# EAGLE design Main-avionics-3.5 (EAGLE 9.6.2)
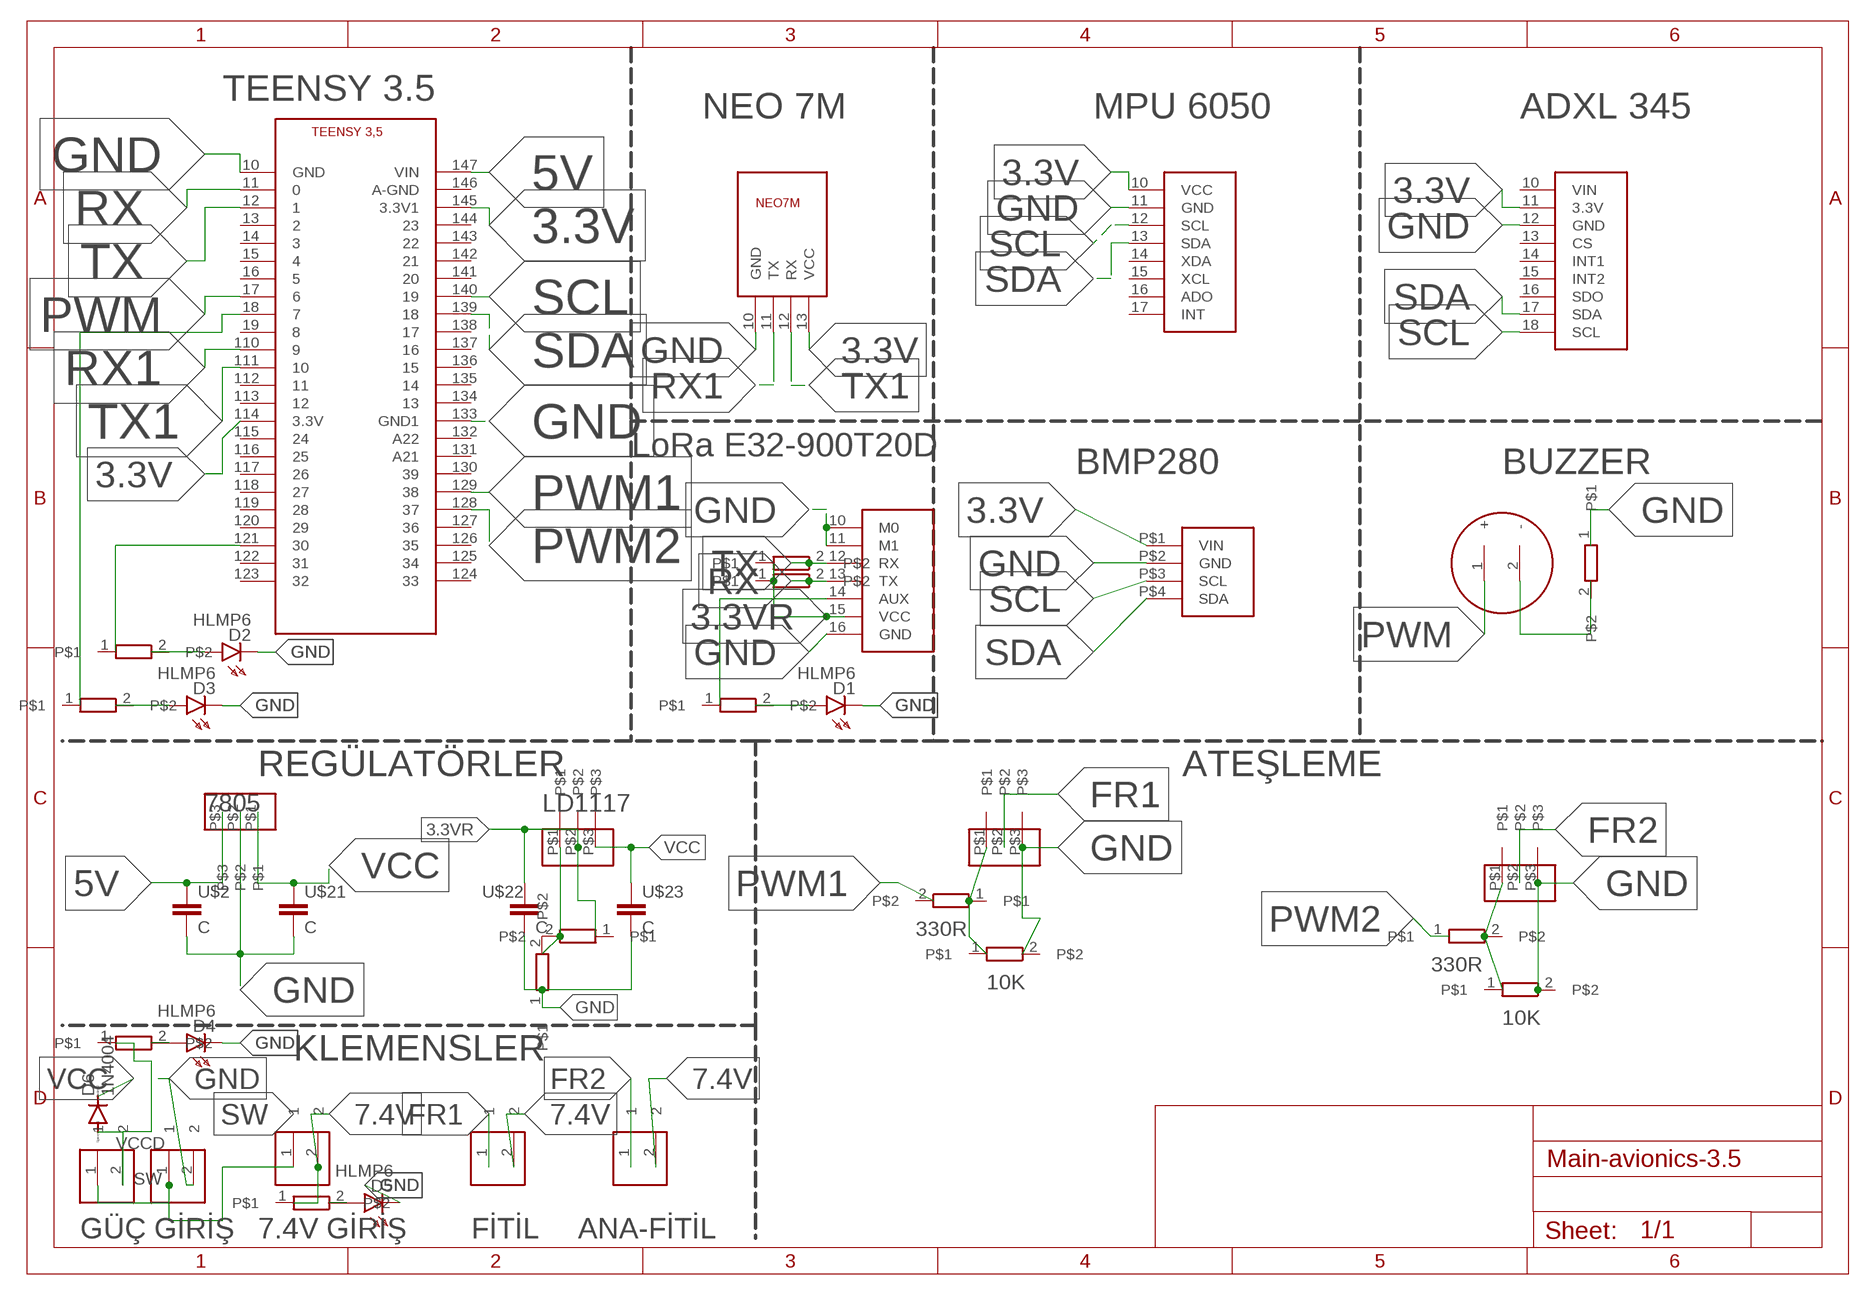
[diagram p0: schematic, sheet 1]

## Parts
1K  R  [0204/7]
10R  R  [0204/7]
10R1  R  [0204/7]
10R2  R  [0204/7]
10R3  R  [0204/7]
10R4  R  [0204/7]
10R5  R  [0204/7]
10R6  R  [0204/7]
10R7  R  [0204/7]
10R8  R  [0204/7]
10R9  R  [0204/7]
D1  HLMP6  [HLMP6]
D2  HLMP6  [HLMP6]
D3  HLMP6  [HLMP6]
D4  HLMP6  [HLMP6]
D5  HLMP6  [HLMP6]
D6  1N4004  [DO41-10]
U$1  ADXL345  [ADXL345]
U$2  C  [C075-032X103]
U$3  BUZZEER  [BUZZER]
U$4  KLEMENS  [KLEMENS]
U$5  KLEMENS  [KLEMENS]
U$6  LORA  [LORA]
U$7  KLEMENS  [KLEMENS]
U$8  NEO7M  [NEO7M]
U$9  REGULATOR  [REGULATOR]
U$11  TEENSY  [TEENSY]
U$13  MPU6050  [MPU6050]
U$14  KLEMENS  [KLEMENS]
U$15  R  [0204/7]
U$16  KLEMENS  [KLEMENS]
U$17  R  [0204/7]
U$18  R  [0204/7]
U$19  REGULATOR  [REGULATOR]
U$20  BMP280  [BMP280]
U$21  C  [C075-032X103]
U$22  C  [C075-032X103]
U$23  C  [C075-032X103]
U$24  REGULATOR  [REGULATOR]
U$25  REGULATOR  [REGULATOR]

## Nets
3.3V: U$1.11(3.3V) U$8.13(VCC) U$11.114(3.3V) U$11.145(3.3V1) U$13.10(VCC) U$20.P$1(VIN)
3.3VR: 10R1.1 10R2.1 10R4.1 U$6.15(VCC) U$22.1 U$24.P$2
5V: U$2.1 U$11.147(VIN) U$19.P$3
7.4V: 10R9.1 U$4.2 U$7.2 U$14.2
FR1: U$4.1 U$25.P$2
FR2: U$7.1 U$9.P$2
GND: 10R5.1 10R.2 D1.K D2.K D3.K D4.K D5.K U$1.12(GND) U$2.2 U$6.10(M0) U$6.11(M1) U$6.16(GND) U$8.10(GND) U$9.P$3 U$11.10(GND) U$11.133(GND1) U$13.11(GND) U$15.1 U$16.2 U$18.2 U$19.P$2 U$20.P$2(GND) U$21.2 U$22.2 U$23.2 U$25.P$3
N$1: U$3.2(-) U$15.2
N$2: U$9.P$1 U$17.2 U$18.1
N$3: 10R3.2 D1.A
N$4: 10R3.1 U$6.14(AUX)
N$6: 1K.1 10R.1 U$25.P$1
N$10: 10R6.2 D2.A
N$11: 10R6.1 U$11.121
N$12: 10R7.2 D3.A
N$13: 10R7.1 U$11.18
N$14: 10R8.2 D4.A
N$15: 10R9.2 D5.A
PWM: U$3.1(+) U$11.17
PWM1: 1K.2 U$11.129
PWM2: U$11.128 U$17.1
RX: 10R2.2 U$6.13(TX) U$11.11
RX1: U$8.11(TX) U$11.110
SCL: U$1.18(SCL) U$11.140 U$13.12(SCL) U$20.P$3(SCL)
SDA: U$1.17(SDA) U$11.139 U$13.13(SDA) U$20.P$4(SDA)
SW: U$5.1 U$14.1 U$16.1
T: 10R4.2 10R5.2 U$24.P$1
TX: 10R1.2 U$6.12(RX) U$11.12
TX1: U$8.12(RX) U$11.111
VCC: D6.C U$19.P$1 U$21.1 U$23.1 U$24.P$3
VCCD: 10R8.1 D6.A U$5.2
Unconnected: U$1.10(VIN) U$1.13(CS) U$1.14(INT1) U$1.15(INT2) U$1.16(SDO) U$11.13 U$11.14 U$11.15 U$11.16 U$11.19 U$11.112 U$11.113 U$11.115 U$11.116 U$11.117 U$11.118 U$11.119 U$11.120 U$11.122 U$11.123 U$11.124 U$11.125 U$11.126 U$11.127 U$11.130 U$11.131(A21) U$11.132(A22) U$11.134 U$11.135 U$11.136 U$11.137 U$11.138 U$11.141 U$11.142 U$11.143 U$11.144 U$11.146(A-GND) U$13.14(XDA) U$13.15(XCL) U$13.16(ADO) U$13.17(INT)

## Notes on the sheet
- TEENSY 3.5
- NEO 7M | MPU 6050 | ADXL 345
- LoRa E32-900T20D
- BMP280 | BUZZER
- REGÜLATÖRLER | ATEŞLEME
- 7805 | LD1117
- 330R
- 330R
- 10K
- 10K
- KLEMENSLER
- GÜÇ GİRİŞ | 7.4V GİRİŞ | FİTİL | ANA-FİTİL

## Library data of the parts
1K 10R 10R1-10R9 U$15 U$17 U$18 = KARTSON:R
D1-D5 = display-hp:HLMP6: LED 2mm horizontal; MF: AGILENT TECHNOLOGIES; MPN: HLMP-6500; OC_FARNELL: 1652490; OC_NEWARK: 40K0088
D6 = diode:1N4004: DIODE general purpose rectifier, 1 A
U$1 = KARTSON:ADXL345
U$2 U$21-U$23 = KARTSON-RE:C
U$3 = KARTSON:BUZZEER
U$4 U$7 U$14 = KARTSON:KLEMENS
U$5 U$16 = KARTYENİ:KLEMENS
U$6 = KARTYENİ:LORA
U$8 = KARTYENİ:NEO7M
U$9 U$19 U$24 U$25 = KARTSON-RE:REGULATOR
U$11 = KARTSON:TEENSY
U$13 = KARTSON:MPU6050
U$20 = KARTSON:BMP280

## Board
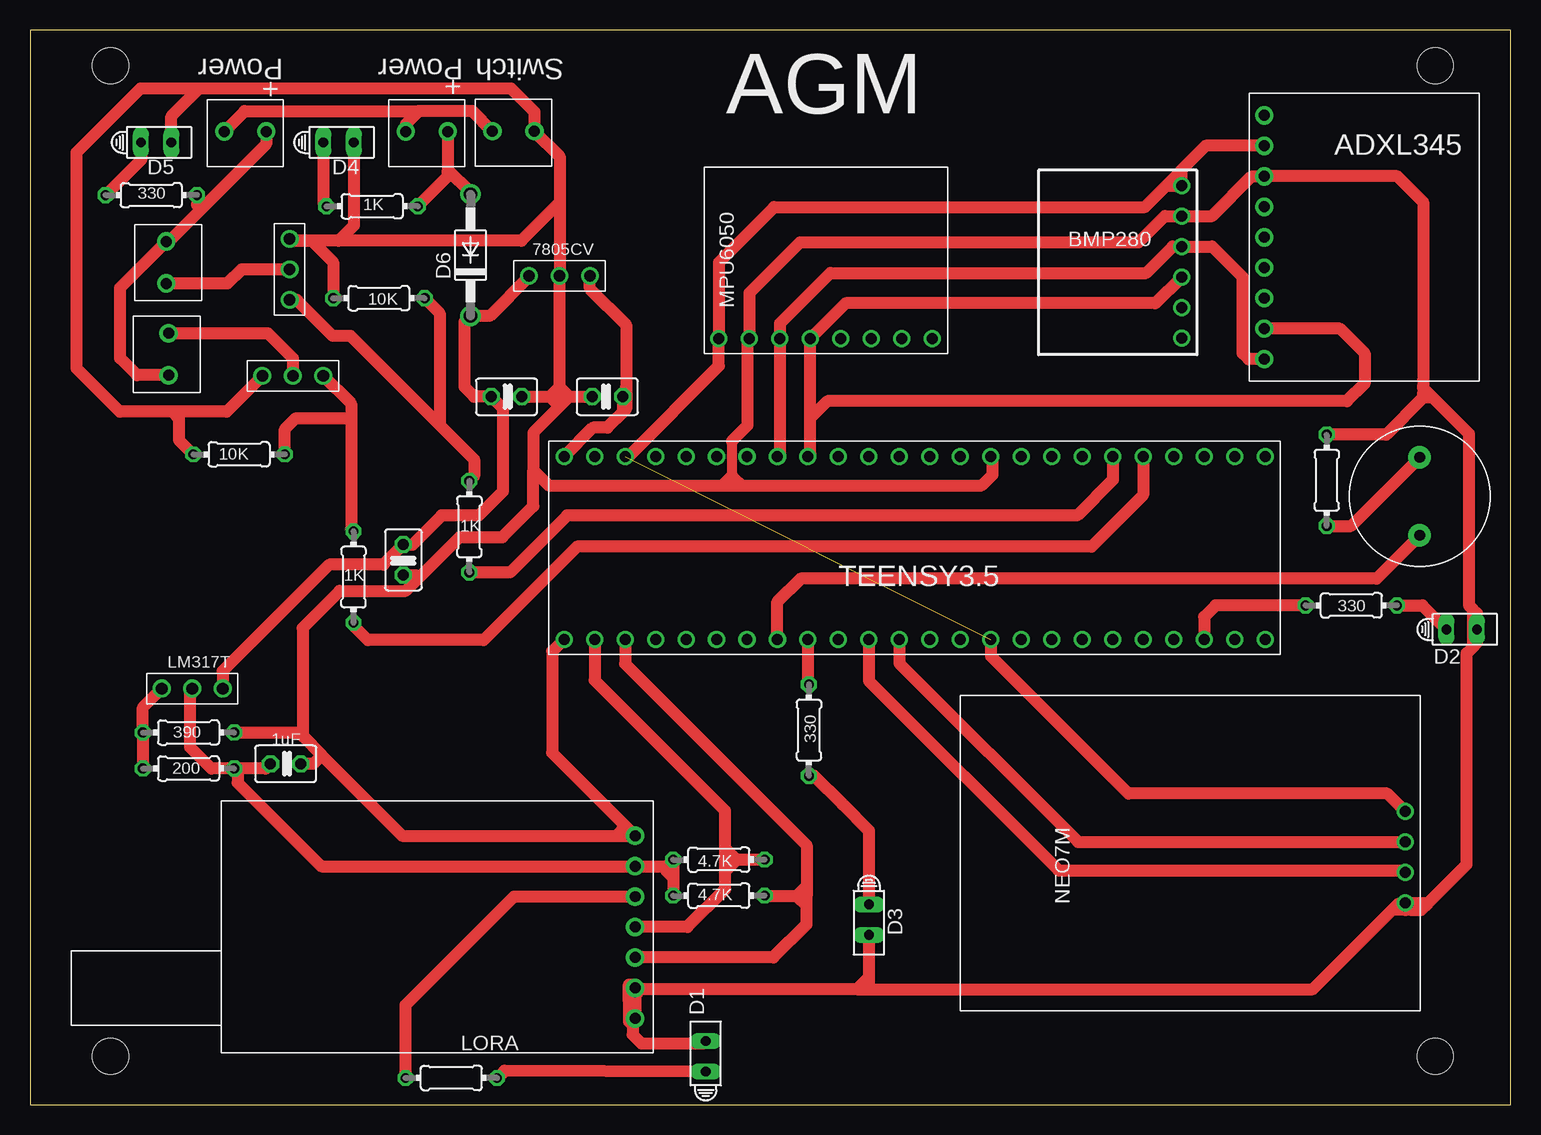
[diagram p1: board, top side]

Size 123.38 x 89.61 mm. Coordinates in mm from the lower left corner, seen from the top.
Outline: 0,0 123.38,0 123.38,89.61 0,89.61 0,0
Copper layers (1*16): Top 0.035mm / dielectric 1.5mm / Bottom 0.035mm
Design rules "default": minimum track width 6mil, minimum drill 0.35mm, track to track 6mil, track to pad 6mil, pad to pad 6mil, via to via 6mil, smd to smd 6mil, copper to edge 40mil, drill to drill 6mil, minimum pad ring 10mil, minimum via ring 8mil, stop-mask expansion 4mil, vias tented up to drill 0mil, thermal gap 10mil
Holes 3 mm at 117.11,86.64 117.11,4.04 6.71,86.64 6.71,4.04

### Footprints (pad centres in the part's own frame; a part is rotated, then mirrored left to right if it is on the bottom)
0204/7 = drill 0.813 octagon: 1 -3.81,0; 2 3.81,0
HLMP6 = drill 0.813 long: A -1.27,0; K 1.27,0
DO41-10 = drill 1.118: A 5.08,0; C -5.08,0
ADXL345 = drill 0.914 pad 1.524: 10 1.27,22.16; 11 1.27,19.62; 12 1.27,17.08; 13 1.27,14.54; 14 1.27,12; 15 1.27,9.46; 16 1.27,6.92; 17 1.27,4.38; 18 1.27,1.84
C075-032X103 = drill 0.914 octagon: 1 -1.27,0; 2 1.27,0
BUZZER = drill 0.889 pad 1.88: 1 -3.251,0; 2 3.251,0
KLEMENS = drill 0.914 pad 1.524: 1 1.425,2.94; 2 4.925,2.94
LORA = drill 0.914 pad 1.524: 10 1.5,18.12; 11 1.5,15.58; 12 1.5,13.04; 13 1.5,10.5; 14 1.5,7.96; 15 1.5,5.42; 16 1.5,2.88
NEO7M = drill 0.914: 10 9,1.27; 11 11.54,1.27; 12 14.08,1.27; 13 16.62,1.27
REGULATOR = drill 0.965: P$1 1.27,1.27; P$2 3.81,1.27; P$3 6.35,1.27
TEENSY = drill 0.914: 10 1.27,59.69; 11 1.27,57.15; 12 1.27,54.61; 13 1.27,52.07; 14 1.27,49.53; 15 1.27,46.99; 16 1.27,44.45; 17 1.27,41.91; 18 1.27,39.37; 19 1.27,36.83; 110 1.27,34.29; 111 1.27,31.75; 112 1.27,29.21; 113 1.27,26.67; 114 1.27,24.13; 115 1.27,21.59; 116 1.27,19.05; 117 1.27,16.51; 118 1.27,13.97; 119 1.27,11.43; 120 1.27,8.89; 121 1.27,6.35; 122 1.27,3.81; 123 1.27,1.27; 124 16.51,1.27; 125 16.51,3.81; 126 16.51,6.35; 127 16.51,8.89; 128 16.51,11.43; 129 16.51,13.97; 130 16.51,16.51; 131 16.51,19.05; 132 16.51,21.59; 133 16.51,24.13; 134 16.51,26.67; 135 16.51,29.21; 136 16.51,31.75; 137 16.51,34.29; 138 16.51,36.83; 139 16.51,39.37; 140 16.51,41.91; 141 16.51,44.45; 142 16.51,46.99; 143 16.51,49.53; 144 16.51,52.07; 145 16.51,54.61; 146 16.51,57.15; 147 16.51,59.69
MPU6050 = drill 0.914: 10 1.27,19.05; 11 1.27,16.51; 12 1.27,13.97; 13 1.27,11.43; 14 1.27,8.89; 15 1.27,6.35; 16 1.27,3.81; 17 1.27,1.27
BMP280 = drill 0.914: P$1 1.27,1.27; P$2 1.27,3.81; P$3 1.27,6.35; P$4 1.27,8.89; P$5 1.27,11.43; P$6 1.27,13.97

### Placement (x,y rotation side)
1K  36.61,48.2 270 top
10R  29.08,67.25 180 top
10R1  57.41,17.44 0 top
10R2  57.41,20.44 0 top
10R3  35.11,2.24 0 top
10R4  13.21,28.04 180 top
10R5  13.21,31.04 180 top
10R6  110.11,41.64 0 top
10R7  64.91,31.24 270 top
10R8  28.51,74.91 180 top
10R9  10.11,75.84 180 top
D1  56.31,4.04 90 top
D2  119.31,39.64 0 top
D3  69.91,15.44 270 top
D4  25.71,80.24 0 top
D5  10.51,80.24 0 top
D6  36.71,70.84 90 top
U$1  101.59,60.33 0 top
U$2  48.11,59.04 180 top
U$3  115.81,50.73 90 top
U$4  14.3,67.05 90 top
U$5  29.89,78.2 0 top
U$6  51.92,25.32 180 top
U$7  8.61,65.75 270 top
U$8  115.86,7.83 90 top
U$9  25.71,62.04 180 top
U$11  104.2,37.54 90 top
U$13  76.46,62.61 90 top
U$14  14.76,78.21 0 top
U$15  108.06,52.07 270 top
U$16  37.11,78.24 0 top
U$17  26.96,44 90 top
U$18  17.42,54.23 180 top
U$19  40.31,67.84 0 top
U$20  97.24,77.91 180 top
U$21  31.11,45.44 270 top
U$22  21.31,28.44 0 top
U$23  39.71,59.04 0 top
U$24  9.71,33.44 0 top
U$25  22.91,65.84 90 top

### Tracks (layer width: path | path; a pad name or v marks a point on that pad's centre or on a via)
3.3V  (1 unrouted)
  Top 1.016: U$11.145 49.85,54.05 57.41,61.61 U$13.10 57.41,70.23 62.02,74.84 92.9,74.84 94.7,76.64 | 94.7,76.64 U$20.P$1 95.97,77.91 | 95.97,77.91 95.97,77.95 97.97,79.95 U$1.11 | 94.7,76.64 95.97,77.91 | U$11.114 80.07,37.41 91.53,25.95 113.09,25.95 U$8.13
3.3VR
  Top 1.016: 53.06,19.9 U$6.15 24.25,19.9 17.31,26.84 17.31,27.75 10R4.1 | 53.06,19.9 10R2.1 53.6,18.94 | 53.6,18.94 10R1.1 | 53.6,18.94 53.06,19.48 53.06,19.9 | U$22.1 19.64,28.04 10R4.1 | 10R4.1 15.11,28.04 13.32,29.83 13.32,34.51 U$24.P$2
5V
  Top 1.016: U$11.147 46.91,56.45 48.11,56.45 49.38,57.72 | U$19.P$3 46.66,68.05 49.68,65.03 49.68,59.84 49.68,59.34 | 49.68,59.34 U$2.1 49.38,57.72 | 49.68,59.34 49.68,58.02 49.38,57.72
7.4V
  Top 1.016: U$7.2 8.93,60.82 7.51,62.24 7.51,68.12 U$4.2 11.56,71.98 14.64,75.05 | U$14.2 19.69,80.1 14.64,75.05 | 10R9.1 13.92,75.05 | 13.92,75.05 13.91,75.04 | 14.64,75.05 13.92,75.05
FR1
  Top 1.016: U$25.P$2 17.63,69.65 16.46,68.48 U$4.1
FR2
  Top 1.016: U$7.1 19.82,64.33 21.9,62.25 U$9.P$2
GND
  Top 0.813: 58.48,55.32 | 58.48,55.32 58.48,52.44
  Top 1.016: 116.08,59.95 116.07,58.95 | 116.08,59.95 116.09,60.44 116.09,75.26 113.94,77.41 U$1.12 101.82,77.41 98.51,74.1 U$20.P$2 94.57,74.1 92.37,71.9 64.16,71.9 59.95,67.69 U$13.11 59.79,63.72 59.79,56.63 58.48,55.32 | 44.14,59.84 44.14,59.04 | 44.14,58.24 44.14,59.04 | U$11.133 80.21,53.91 80.21,52.54 79.31,51.64 59.11,51.64 | 57.68,51.64 43.21,51.64 41.94,52.91 | 57.68,51.64 58.51,51.64 | 58.51,51.64 59.11,51.64 | 14.11,84.74 40.08,84.74 42.04,82.78 U$16.2 44.14,79.08 44.14,75.24 | 115.21,16.83 U$8.10 114.5,16.74 | 115.21,16.83 115.71,16.83 | 115.71,16.83 116.5,16.83 | 116.5,16.83 119.71,20.04 119.71,37.64 120.21,38.14 | 116.91,58.95 116.07,58.95 | U$11.10 43.51,37.81 43.51,29.35 49.66,23.2 | 49.66,23.2 U$6.16 48.91,22.44 | U$6.11 50.42,9.15 | 50.42,9.15 U$6.10 50.42,8.14 50.22,8.34 | D1.K 56.11,5.11 50.95,5.11 50.22,5.84 50.22,6.64 | 50.22,6.64 50.22,8.34 | 68.91,9.64 50.91,9.64 | 68.91,9.64 70.11,9.64 | 70.11,9.64 106.9,9.64 113.5,16.24 | 113.5,16.24 114,16.74 114.5,16.74 | 114.5,16.74 115.12,16.74 | 115.12,16.74 115.21,16.83 | 116.91,58.95 119.91,55.95 119.91,41.64 120.58,40.97 D2.K 120.58,38.51 120.21,38.14 | 116.91,58.95 116.08,59.77 116.08,59.95 | 32.41,43.94 35.8,47.33 39.36,47.33 41.94,49.91 41.94,52.91 | 32.41,43.94 31.31,42.84 25.81,42.84 22.71,39.74 22.71,30.74 | 24.31,29.14 31.01,22.44 48.91,22.44 | 48.91,22.44 49.66,23.2 | 115.12,16.74 114.62,16.24 | 114.62,16.24 113.5,16.24 | 50.22,8.34 49.91,8.65 | 49.91,8.65 49.91,10.04 50.51,10.04 50.91,9.64 | 49.91,8.65 49.91,6.95 50.22,6.64 | D3.K 69.91,10.64 | 69.91,10.64 68.91,9.64 | 69.91,10.64 69.91,9.84 70.11,9.64 | 22.71,30.74 22.41,31.04 10R5.1
  Top 1.016: 22.71,30.74 24.31,29.14 | U$23.2 43.31,59.04 | 44.14,59.04 43.31,59.04 | 44.14,59.04 44.94,59.04 | 44.94,59.04 U$2.2 | D5.K 11.78,82.41 14.11,84.74 | 115.71,16.83 115.12,16.24 | 115.12,16.24 114.62,16.24 | 115.12,16.24 115.91,16.24 116.5,16.83 | 43.31,59.04 44.11,59.84 44.14,59.84 | 44.14,59.84 44.94,59.04 | 44.94,59.04 44.14,58.24 | 44.14,58.24 41.94,56.04 41.94,52.91 | 43.31,59.04 44.11,58.24 44.14,58.24 | 50.91,9.64 50.42,9.15 | 11.84,57.79 7.48,57.79 3.88,61.39 3.88,79.41 9.21,84.74 14.11,84.74 | 58.51,51.64 58.48,51.67 58.48,52.44 | 58.48,52.44 57.68,51.64 | 58.48,52.44 59.11,51.81 59.11,51.64 | U$18.2 12.41,55.43 12.41,57.22 11.84,57.79 | 116.07,58.95 113,55.88 U$15.1 | 44.14,75.24 44.14,69.09 | 44.14,69.09 U$19.P$2 | 44.14,59.84 44.14,69.09 | 24.31,29.14 23.61,28.44 U$22.2 | U$21.2 32.18,44.17 32.41,43.94 | 119.98,41.57 120.21,41.34 120.21,38.14 | 10R.2 25.27,70.25 23.53,71.99 21.84,71.99 U$25.P$3 21.79,72.04 25.71,72.04 | U$9.P$3 16.38,57.79 11.84,57.79 | 44.14,75.24 40.94,72.04 25.71,72.04 | D4.K 26.98,73.31 25.71,72.04
N$1
  Top 1.016: U$15.2 110.09,48.26 U$3.2
N$2
  Top 1.016: 26.76,57.24 26.76,48.01 U$17.2 | 26.76,57.24 22.15,57.24 21.23,56.32 U$18.1 | 26.76,57.24 26.76,58.45 U$9.P$1
N$3
  Top 1.016: D1.A 39.55,2.86 10R3.2
N$4
  Top 1.016: U$6.14 40.33,17.36 31.3,8.33 10R3.1
N$6
  Top 1.016: 1K.1 37.01,52.41 37.01,53.81 34.15,56.67 | U$25.P$1 22.24,67.11 25.24,64.11 26.71,64.11 34.15,56.67 | 34.15,56.67 34.15,66 10R.1
N$10
  Top 1.016: D2.A 116.04,41.64 10R6.2
N$11
  Top 1.016: 10R6.1 98.8,41.64 97.85,40.69 U$11.121
N$12
  Top 1.016: 10R7.2 65.32,27.43 67.71,25.04 69.91,22.84 D3.A
N$13
  Top 1.016: U$11.18 64.83,35.13 10R7.1
N$14
  Top 1.016: D4.A 24.44,75.17 10R8.2
N$15
  Top 1.016: 10R9.2 9.31,78.84 9.31,80.17 D5.A
PWM
  Top 1.016: U$11.17 62.29,41.95 64.22,43.88 112.21,43.88 U$3.1
PWM1
  Top 1.016: U$11.129 90.23,52.11 87.26,49.14 44.76,49.14 40.01,44.39 1K.2
PWM2
  Top 1.016: U$11.128 92.77,50.84 88.46,46.53 45.6,46.53 37.81,38.74 28.16,38.74 26.84,40.06 U$17.1
RX
  Top 1.016: U$11.11 47.05,35.4 57.91,24.54 57.91,21.44 | U$6.13 54.79,14.82 57.91,17.94 57.91,19.44 | 10R2.2 58.91,20.44 | 57.91,20.44 58.91,20.44 | 57.91,21.44 57.91,20.44 | 57.91,20.44 57.91,19.44 | 57.91,21.44 58.91,20.44 | 58.91,20.44 57.91,19.44
RX1
  Top 1.016: U$11.110 69.91,35.34 85.71,19.54 114.42,19.54 U$8.11
SCL
  Top 1.016: U$11.140 62.49,54.25 U$13.12 62.49,65.15 66.7,69.36 93.01,69.36 95.21,71.56 U$20.P$3 98.51,71.56 101.05,69.02 101.05,62.67 101.55,62.17 U$1.18
SDA
  Top 1.016: U$11.139 65.03,54.25 65.03,57.24 | 65.03,57.24 U$13.13 67.97,66.82 93.77,66.82 U$20.P$4 | U$1.17 109.17,64.71 111.21,62.67 111.21,60.13 109.74,58.66 66.45,58.66 65.03,57.24
SW
  Top 1.016: U$14.1 17.88,82.84 32.38,82.84 | U$16.1 36.88,82.84 32.38,82.84 | 32.38,82.84 31.31,81.78 U$5.1
T
  Top 1.016: 10R5.2 9.4,31.18 | 10R5.2 10R4.2 | 10R5.2 9.4,33.13 U$24.P$1
TX
  Top 1.016: U$11.12 49.59,36.76 64.71,21.64 64.71,18.24 | U$6.12 61.95,12.28 64.71,15.04 64.71,16.64 | 64.71,18.24 64.71,17.44 | 10R1.2 63.91,17.44 | 64.71,17.44 63.91,17.44 | 64.71,16.64 64.71,17.44 | 63.91,17.44 64.71,18.24 | 63.91,17.44 64.71,16.64
TX1
  Top 1.016: U$11.111 72.45,36.8 87.34,21.91 U$8.12
VCC
  Top 1.016: U$19.P$1 41.58,69.03 38.31,65.76 D6.C 36.21,65.26 36.21,59.84 37.01,59.04 U$23.1 39.41,58.07 39.41,51.14 37.41,49.14 34.31,49.14 31.88,46.71 U$21.1 29.44,45.04 24.94,45.04 16.06,36.16 U$24.P$3
VCCD
  Top 1.016: D6.A 36.71,76.05 34.81,77.94 | U$5.2 34.81,77.94 | 10R8.1 34.81,77.41 34.81,77.94

### Text on the board
tPlace: Power | Power | Switch | + | + | AGM | ADXL345 | 330 | 1K | 7805CV | 10K | 10K | 1K | 1K | TEENSY3.5 | 330 | LM317T | 390 | 1uF | 330 | 200 | 4.7K | 4.7K